# Altium schematic sheet 2_Unextended_Standard_matrix.SchDoc: =ProjectTitle
size A3; Address1: github.com/4pplet/Unextended; Address2: Licence: CERN-OHL-S; SheetNumber: 2; SheetTotal: 4
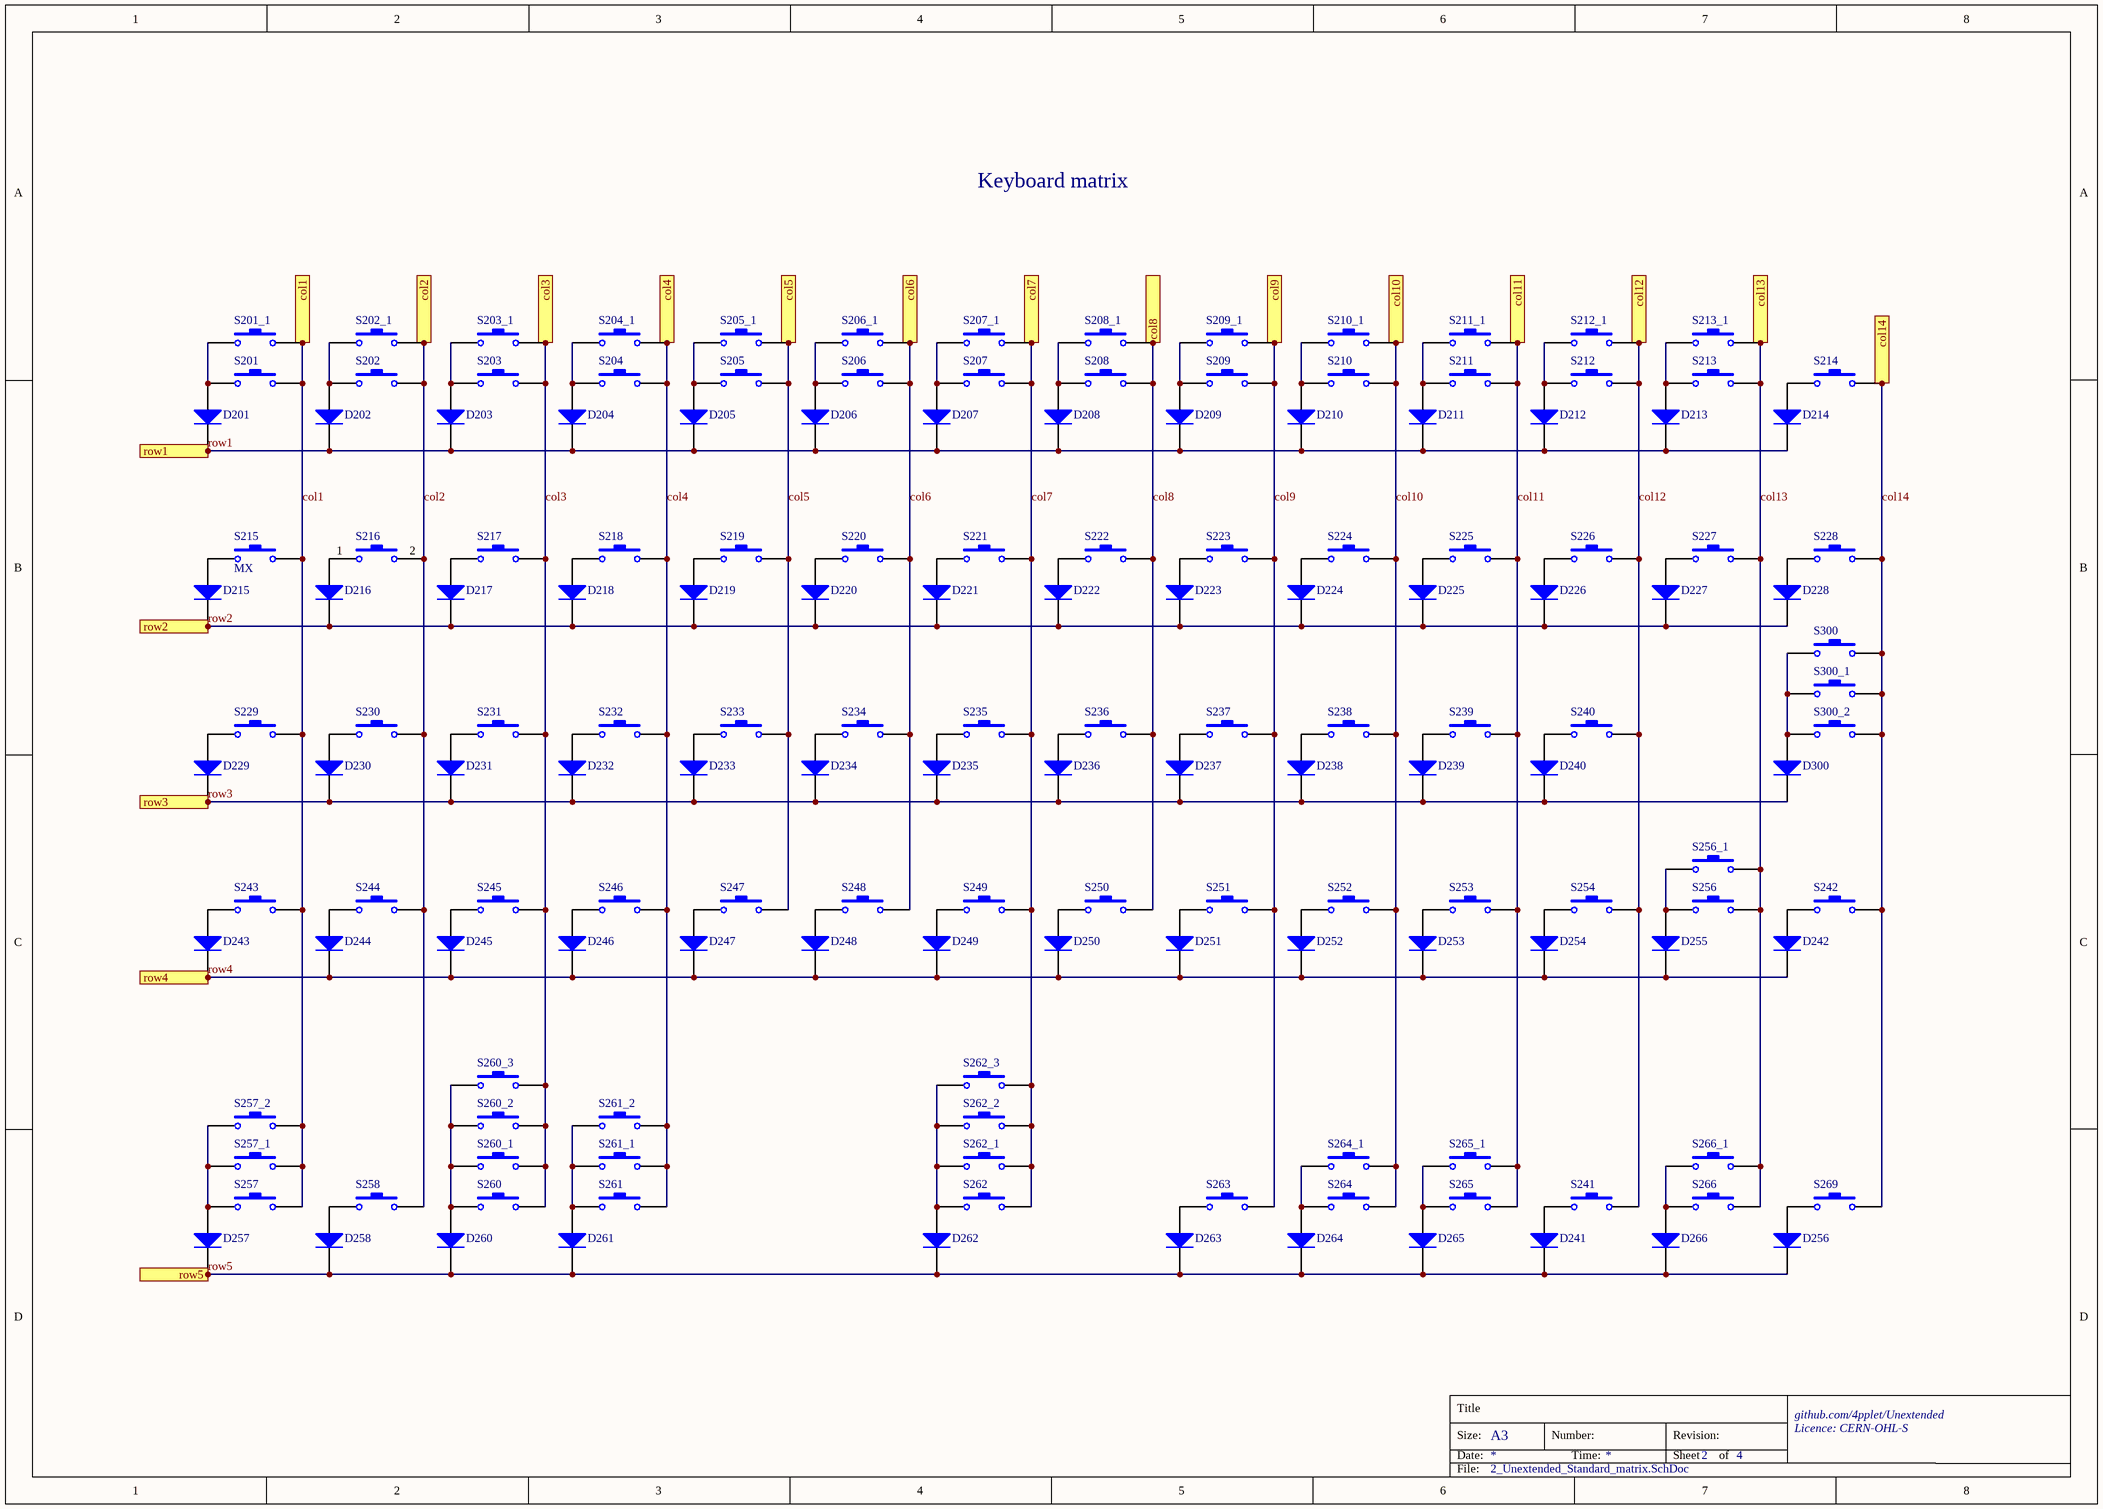
[diagram p0: 2_Unextended_Standard_matrix.SchDoc]

## Parts
D201  Diode  [SOD-123]  (value not drawn)
D202  Diode  [SOD-123]  (value not drawn)
D203  Diode  [SOD-123]  (value not drawn)
D204  Diode  [SOD-123]  (value not drawn)
D205  Diode  [SOD-123]  (value not drawn)
D206  Diode  [SOD-123]  (value not drawn)
D207  Diode  [SOD-123]  (value not drawn)
D208  Diode  [SOD-123]  (value not drawn)
D209  Diode  [SOD-123]  (value not drawn)
D210  Diode  [SOD-123]  (value not drawn)
D211  Diode  [SOD-123]  (value not drawn)
D212  Diode  [SOD-123]  (value not drawn)
D213  Diode  [SOD-123]  (value not drawn)
D214  Diode  [SOD-123]  (value not drawn)
D215  Diode  [SOD-123]  (value not drawn)
D216  Diode  [SOD-123]  (value not drawn)
D217  Diode  [SOD-123]  (value not drawn)
D218  Diode  [SOD-123]  (value not drawn)
D219  Diode  [SOD-123]  (value not drawn)
D220  Diode  [SOD-123]  (value not drawn)
D221  Diode  [SOD-123]  (value not drawn)
D222  Diode  [SOD-123]  (value not drawn)
D223  Diode  [SOD-123]  (value not drawn)
D224  Diode  [SOD-123]  (value not drawn)
D225  Diode  [SOD-123]  (value not drawn)
D226  Diode  [SOD-123]  (value not drawn)
D227  Diode  [SOD-123]  (value not drawn)
D228  Diode  [SOD-123]  (value not drawn)
D229  Diode  [SOD-123]  (value not drawn)
D230  Diode  [SOD-123]  (value not drawn)
D231  Diode  [SOD-123]  (value not drawn)
D232  Diode  [SOD-123]  (value not drawn)
D233  Diode  [SOD-123]  (value not drawn)
D234  Diode  [SOD-123]  (value not drawn)
D235  Diode  [SOD-123]  (value not drawn)
D236  Diode  [SOD-123]  (value not drawn)
D237  Diode  [SOD-123]  (value not drawn)
D238  Diode  [SOD-123]  (value not drawn)
D239  Diode  [SOD-123]  (value not drawn)
D240  Diode  [SOD-123]  (value not drawn)
D241  Diode  [SOD-123]  (value not drawn)
D242  Diode  [SOD-123]  (value not drawn)
D243  Diode  [SOD-123]  (value not drawn)
D244  Diode  [SOD-123]  (value not drawn)
D245  Diode  [SOD-123]  (value not drawn)
D246  Diode  [SOD-123]  (value not drawn)
D247  Diode  [SOD-123]  (value not drawn)
D248  Diode  [SOD-123]  (value not drawn)
D249  Diode  [SOD-123]  (value not drawn)
D250  Diode  [SOD-123]  (value not drawn)
D251  Diode  [SOD-123]  (value not drawn)
D252  Diode  [SOD-123]  (value not drawn)
D253  Diode  [SOD-123]  (value not drawn)
D254  Diode  [SOD-123]  (value not drawn)
D255  Diode  [SOD-123]  (value not drawn)
D256  Diode  [SOD-123]  (value not drawn)
D257  Diode  [SOD-123]  (value not drawn)
D258  Diode  [SOD-123]  (value not drawn)
D260  Diode  [SOD-123]  (value not drawn)
D261  Diode  [SOD-123]  (value not drawn)
D262  Diode  [SOD-123]  (value not drawn)
D263  Diode  [SOD-123]  (value not drawn)
D264  Diode  [SOD-123]  (value not drawn)
D265  Diode  [SOD-123]  (value not drawn)
D266  Diode  [SOD-123]  (value not drawn)
D300  Diode  [SOD-123]  (value not drawn)
S201  ALPS  [Alps-switch - switched pol]  (value not drawn)  (no BOM)
S201_1  ALPS  [Alps-switch]  (value not drawn)  (no BOM)
S202  ALPS  [Alps-switch - switched pol]  (value not drawn)  (no BOM)
S202_1  ALPS  [Alps-switch]  (value not drawn)  (no BOM)
S203  ALPS  [Alps-switch - switched pol]  (value not drawn)  (no BOM)
S203_1  ALPS  [Alps-switch]  (value not drawn)  (no BOM)
S204  ALPS  [Alps-switch - switched pol]  (value not drawn)  (no BOM)
S204_1  ALPS  [Alps-switch]  (value not drawn)  (no BOM)
S205  ALPS  [Alps-switch - switched pol]  (value not drawn)  (no BOM)
S205_1  ALPS  [Alps-switch]  (value not drawn)  (no BOM)
S206  ALPS  [Alps-switch - switched pol]  (value not drawn)  (no BOM)
S206_1  ALPS  [Alps-switch]  (value not drawn)  (no BOM)
S207  ALPS  [Alps-switch - switched pol]  (value not drawn)  (no BOM)
S207_1  ALPS  [Alps-switch]  (value not drawn)  (no BOM)
S208  ALPS  [Alps-switch - switched pol]  (value not drawn)  (no BOM)
S208_1  ALPS  [Alps-switch]  (value not drawn)  (no BOM)
S209  ALPS  [Alps-switch - switched pol]  (value not drawn)  (no BOM)
S209_1  ALPS  [Alps-switch]  (value not drawn)  (no BOM)
S210  ALPS  [Alps-switch - switched pol]  (value not drawn)  (no BOM)
S210_1  ALPS  [Alps-switch]  (value not drawn)  (no BOM)
S211  ALPS  [Alps-switch - switched pol]  (value not drawn)  (no BOM)
S211_1  ALPS  [Alps-switch]  (value not drawn)  (no BOM)
S212  ALPS  [Alps-switch - switched pol]  (value not drawn)  (no BOM)
S212_1  ALPS  [Alps-switch]  (value not drawn)  (no BOM)
S213  ALPS  [Alps-switch - switched pol]  (value not drawn)  (no BOM)
S213_1  ALPS  [Alps-switch]  (value not drawn)  (no BOM)
S214  ALPS  [ALPS-switch - 1.5U]  (value not drawn)  (no BOM)
S215  MX  [Alps-switch - switched pol]  (no BOM)
S216  ALPS  [Alps-switch]  (value not drawn)  (no BOM)
S217  ALPS  [Alps-switch - switched pol]  (value not drawn)  (no BOM)
S218  ALPS  [Alps-switch - switched pol]  (value not drawn)  (no BOM)
S219  ALPS  [Alps-switch - switched pol]  (value not drawn)  (no BOM)
S220  ALPS  [Alps-switch - switched pol]  (value not drawn)  (no BOM)
S221  ALPS  [Alps-switch - switched pol]  (value not drawn)  (no BOM)
S222  ALPS  [Alps-switch - switched pol]  (value not drawn)  (no BOM)
S223  ALPS  [Alps-switch - switched pol]  (value not drawn)  (no BOM)
S224  ALPS  [Alps-switch - switched pol]  (value not drawn)  (no BOM)
S225  ALPS  [Alps-switch - switched pol]  (value not drawn)  (no BOM)
S226  ALPS  [Alps-switch]  (value not drawn)  (no BOM)
S227  ALPS  [Alps-switch]  (value not drawn)  (no BOM)
S228  ALPS  [Alps-switch - switched pol]  (value not drawn)  (no BOM)
S229  ALPS  [Alps-switch - switched pol]  (value not drawn)  (no BOM)
S230  ALPS  [Alps-switch]  (value not drawn)  (no BOM)
S231  ALPS  [Alps-switch - switched pol]  (value not drawn)  (no BOM)
S232  ALPS  [Alps-switch - switched pol]  (value not drawn)  (no BOM)
S233  ALPS  [Alps-switch - switched pol]  (value not drawn)  (no BOM)
S234  ALPS  [Alps-switch - switched pol]  (value not drawn)  (no BOM)
S235  ALPS  [Alps-switch - switched pol]  (value not drawn)  (no BOM)
S236  ALPS  [Alps-switch - switched pol]  (value not drawn)  (no BOM)
S237  ALPS  [Alps-switch - switched pol]  (value not drawn)  (no BOM)
S238  ALPS  [Alps-switch - switched pol]  (value not drawn)  (no BOM)
S239  ALPS  [Alps-switch - switched pol]  (value not drawn)  (no BOM)
S240  ALPS  [Alps-switch - switched pol]  (value not drawn)  (no BOM)
S241  ALPS  [Alps-switch]  (value not drawn)  (no BOM)
S242  ALPS  [Alps-switch]  (value not drawn)  (no BOM)
S243  ALPS  [ALPS-switch - Left shift v2]  (value not drawn)  (no BOM)
S244  ALPS  [Alps-switch]  (value not drawn)  (no BOM)
S245  ALPS  [Alps-switch - switched pol]  (value not drawn)  (no BOM)
S246  ALPS  [Alps-switch - switched pol]  (value not drawn)  (no BOM)
S247  ALPS  [Alps-switch - switched pol]  (value not drawn)  (no BOM)
S248  ALPS  [Alps-switch - switched pol]  (value not drawn)  (no BOM)
S249  ALPS  [Alps-switch - switched pol]  (value not drawn)  (no BOM)
S250  ALPS  [Alps-switch - switched pol]  (value not drawn)  (no BOM)
S251  ALPS  [Alps-switch - switched pol]  (value not drawn)  (no BOM)
S252  ALPS  [Alps-switch - switched pol]  (value not drawn)  (no BOM)
S253  ALPS  [Alps-switch - switched pol]  (value not drawn)  (no BOM)
S254  ALPS  [Alps-switch - switched pol]  (value not drawn)  (no BOM)
S256  ALPS  [ALPS-switch - 2.25U]  (value not drawn)  (no BOM)
S256_1  ALPS  [Alps-switch - switched pol]  (value not drawn)  (no BOM)
S257  ALPS  [Alps-switch - switched pol]  (value not drawn)  (no BOM)
S257_1  ALPS  [Alps-switch]  (value not drawn)  (no BOM)
S257_2  ALPS  [Alps-switch]  (value not drawn)  (no BOM)
S258  ALPS  [Alps-switch]  (value not drawn)  (no BOM)
S260  ALPS  [Alps-switch]  (value not drawn)  (no BOM)
S260_1  ALPS  [Alps-switch - switched pol]  (value not drawn)  (no BOM)
S260_2  ALPS  [Alps-switch]  (value not drawn)  (no BOM)
S260_3  ALPS  [Alps-switch - switched pol]  (value not drawn)  (no BOM)
S261  ALPS  [Alps-switch]  (value not drawn)  (no BOM)
S261_1  ALPS  [Alps-switch - switched pol]  (value not drawn)  (no BOM)
S261_2  ALPS  [Alps-switch - switched pol]  (value not drawn)  (no BOM)
S262  ALPS  [Alps-switch]  (value not drawn)  (no BOM)
S262_1  ALPS  [Alps-switch]  (value not drawn)  (no BOM)
S262_2  ALPS  [Alps-switch - switched pol]  (value not drawn)  (no BOM)
S262_3  ALPS  [Alps-switch]  (value not drawn)  (no BOM)
S263  ALPS  [Alps-switch]  (value not drawn)  (no BOM)
S264  ALPS  [Alps-switch - switched pol]  (value not drawn)  (no BOM)
S264_1  ALPS  [Alps-switch]  (value not drawn)  (no BOM)
S265  ALPS  [Alps-switch - switched pol]  (value not drawn)  (no BOM)
S265_1  ALPS  [Alps-switch]  (value not drawn)  (no BOM)
S266  ALPS  [Alps-switch - switched pol]  (value not drawn)  (no BOM)
S266_1  ALPS  [Alps-switch]  (value not drawn)  (no BOM)
S269  ALPS  [Alps-switch]  (value not drawn)  (no BOM)
S300  ALPS  [Alps-switch]  (value not drawn)  (no BOM)
S300_1  ALPS  [Alps-switch]  (value not drawn)  (no BOM)
S300_2  ALPS  [Alps-switch - switched pol]  (value not drawn)  (no BOM)

## Ports
col1, col2, col3, col4, col5, col6, col7, col8, col9, col10, col11, col12, col13, col14, row1, row2, row3, row4, row5

## Nets
col1: S201.2 S201_1.2 S215.2 S229.2 S243.2 S257.1 S257_1.1 S257_2.1 ; port col1
col2: S202.2 S202_1.2 S216.2 S230.2 S244.1 S258.2 ; port col2
col3: S203.2 S203_1.2 S217.2 S231.2 S245.2 S260.2 S260_1.2 S260_2.2 S260_3.2 ; port col3
col4: S204.2 S204_1.2 S218.2 S232.2 S246.2 S261.2 S261_1.2 S261_2.2 ; port col4
col5: S205.2 S205_1.2 S219.2 S233.2 S247.2 ; port col5
col6: S206.2 S206_1.2 S220.2 S234.2 S248.2 ; port col6
col7: S207.2 S207_1.2 S221.2 S235.2 S249.2 S262.1 S262_1.1 S262_2.1 S262_3.1 ; port col7
col8: S208.2 S208_1.2 S222.2 S236.2 S250.2 ; port col8
col9: S209.2 S209_1.2 S223.2 S237.2 S251.2 S263.1 ; port col9
col10: S210.2 S210_1.2 S224.2 S238.2 S252.2 S264.2 S264_1.2 ; port col10
col11: S211.2 S211_1.2 S225.2 S239.2 S253.2 S265.1 S265_1.1 ; port col11
col12: S212.2 S212_1.2 S226.2 S240.2 S241.1 S254.2 ; port col12
col13: S213.2 S213_1.2 S227.2 S256.1 S256_1.1 S266.2 S266_1.2 ; port col13
col14: S214.2 S228.2 S242.2 S269.2 S300.2 S300_1.2 S300_2.2 ; port col14
row1: D201.2(K) D202.2(K) D203.2(K) D204.2(K) D205.2(K) D206.2(K) D207.2(K) D208.2(K) D209.2(K) D210.2(K) D211.2(K) D212.2(K) D213.2(K) D214.2(K) ; port row1
row2: D215.2(K) D216.2(K) D217.2(K) D218.2(K) D219.2(K) D220.2(K) D221.2(K) D222.2(K) D223.2(K) D224.2(K) D225.2(K) D226.2(K) D227.2(K) D228.2(K) ; port row2
row3: D229.2(K) D230.2(K) D231.2(K) D232.2(K) D233.2(K) D234.2(K) D235.2(K) D236.2(K) D237.2(K) D238.2(K) D239.2(K) D240.2(K) D300.2(K) ; port row3
row4: D242.2(K) D243.2(K) D244.2(K) D245.2(K) D246.2(K) D247.2(K) D248.2(K) D249.2(K) D250.2(K) D251.2(K) D252.2(K) D253.2(K) D254.2(K) D255.2(K) ; port row4
row5: D241.2(K) D256.2(K) D257.2(K) D258.2(K) D260.2(K) D261.2(K) D262.2(K) D263.2(K) D264.2(K) D265.2(K) D266.2(K) ; port row5
NetD201_1: D201.1(A) S201.1 S201_1.1
NetD202_1: D202.1(A) S202.1 S202_1.1
NetD203_1: D203.1(A) S203.1 S203_1.1
NetD204_1: D204.1(A) S204.1 S204_1.1
NetD205_1: D205.1(A) S205.1 S205_1.1
NetD206_1: D206.1(A) S206.1 S206_1.1
NetD207_1: D207.1(A) S207.1 S207_1.1
NetD208_1: D208.1(A) S208.1 S208_1.1
NetD209_1: D209.1(A) S209.1 S209_1.1
NetD210_1: D210.1(A) S210.1 S210_1.1
NetD211_1: D211.1(A) S211.1 S211_1.1
NetD212_1: D212.1(A) S212.1 S212_1.1
NetD213_1: D213.1(A) S213.1 S213_1.1
NetD214_1: D214.1(A) S214.1
NetD215_1: D215.1(A) S215.1
NetD216_1: D216.1(A) S216.1
NetD217_1: D217.1(A) S217.1
NetD218_1: D218.1(A) S218.1
NetD219_1: D219.1(A) S219.1
NetD220_1: D220.1(A) S220.1
NetD221_1: D221.1(A) S221.1
NetD222_1: D222.1(A) S222.1
NetD223_1: D223.1(A) S223.1
NetD224_1: D224.1(A) S224.1
NetD225_1: D225.1(A) S225.1
NetD226_1: D226.1(A) S226.1
NetD227_1: D227.1(A) S227.1
NetD228_1: D228.1(A) S228.1
NetD229_1: D229.1(A) S229.1
NetD230_1: D230.1(A) S230.1
NetD231_1: D231.1(A) S231.1
NetD232_1: D232.1(A) S232.1
NetD233_1: D233.1(A) S233.1
NetD234_1: D234.1(A) S234.1
NetD235_1: D235.1(A) S235.1
NetD236_1: D236.1(A) S236.1
NetD237_1: D237.1(A) S237.1
NetD238_1: D238.1(A) S238.1
NetD239_1: D239.1(A) S239.1
NetD240_1: D240.1(A) S240.1
NetD241_1: D241.1(A) S241.2
NetD242_1: D242.1(A) S242.1
NetD243_1: D243.1(A) S243.1
NetD244_1: D244.1(A) S244.2
NetD245_1: D245.1(A) S245.1
NetD246_1: D246.1(A) S246.1
NetD247_1: D247.1(A) S247.1
NetD248_1: D248.1(A) S248.1
NetD249_1: D249.1(A) S249.1
NetD250_1: D250.1(A) S250.1
NetD251_1: D251.1(A) S251.1
NetD252_1: D252.1(A) S252.1
NetD253_1: D253.1(A) S253.1
NetD254_1: D254.1(A) S254.1
NetD255_1: D255.1(A) S256.2 S256_1.2
NetD256_1: D256.1(A) S269.1
NetD257_1: D257.1(A) S257.2 S257_1.2 S257_2.2
NetD258_1: D258.1(A) S258.1
NetD260_1: D260.1(A) S260.1 S260_1.1 S260_2.1 S260_3.1
NetD261_1: D261.1(A) S261.1 S261_1.1 S261_2.1
NetD262_1: D262.1(A) S262.2 S262_1.2 S262_2.2 S262_3.2
NetD263_1: D263.1(A) S263.2
NetD264_1: D264.1(A) S264.1 S264_1.1
NetD265_1: D265.1(A) S265.2 S265_1.2
NetD266_1: D266.1(A) S266.1 S266_1.1
NetD300_1: D300.1(A) S300.1 S300_1.1 S300_2.1

## Notes on the sheet
- Keyboard matrix
- Title
- Size:
- Date:
- A3
- Number:
- Time:
- Revision:
- Sheet
- of
- File:

## Library data of the parts
D201-D258 D260-D266 D300 = Diode: Default Diode; MRF.Part: 1N4148W; LCSC MFG: ST(Semtech); Version: SOD-123; LCSC Part #: C81598
S201 S201_1 S202 S202_1 S203 S203_1 S204 S204_1 S205 S205_1 S206 S206_1 S207 S207_1 S208 S208_1 S209 S209_1 S210 S210_1 S211 S211_1 S212 S212_1 S213 S213_1 S214 S216-S254 S256 S256_1 S257 S257_1 S257_2 S258 S260 S260_1-S260_3 S261 S261_1 S261_2 S262 S262_1-S262_3 S263 S264 S264_1 S265 S265_1 S266 S266_1 S269 S300 S300_1 S300_2 = SW-PB: Switch
S215 = SW-PB: TAB